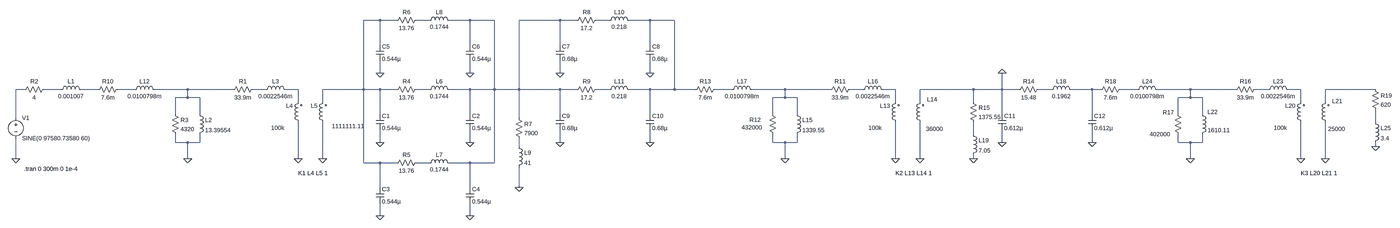
[diagram p0: schematic minhalinha .asc, whole sheet]
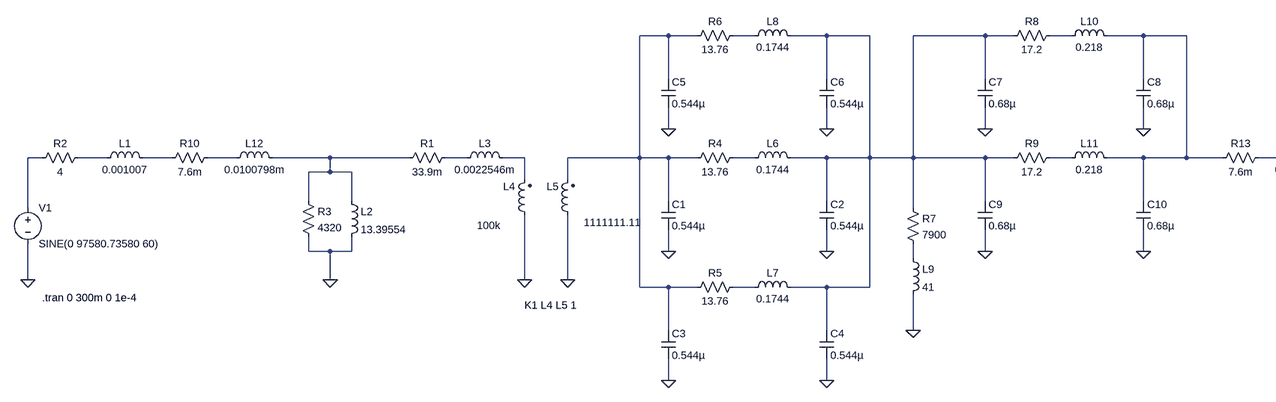
[diagram p1: schematic minhalinha .asc, part, row 1 of 1, column 1 of 2]
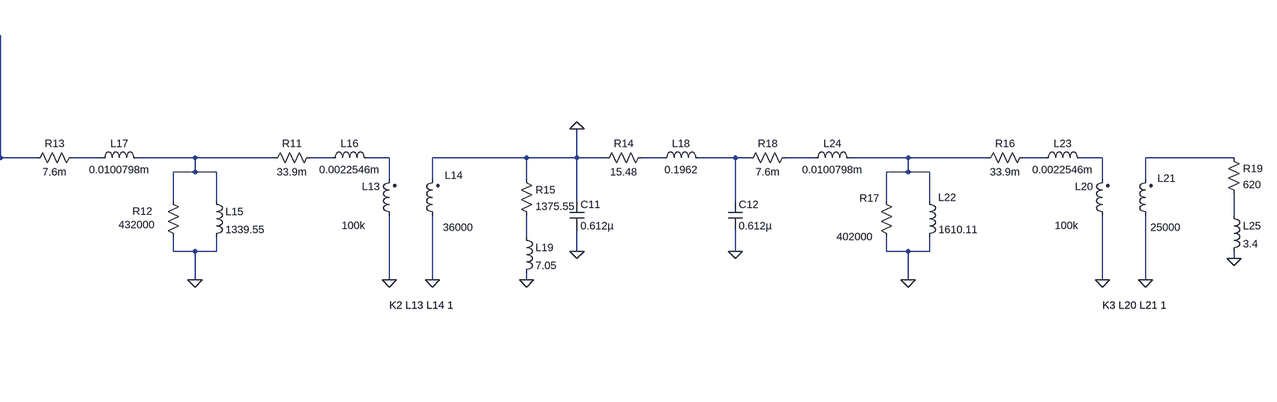
[diagram p2: schematic minhalinha .asc, part, row 1 of 1, column 2 of 2]
minhalinha .asc, the LTspice schematic file:
Version 4
SHEET 1 5188 680
WIRE 1200 -272 1136 -272
WIRE 1264 -272 1200 -272
WIRE 1392 -272 1344 -272
WIRE 1552 -272 1472 -272
WIRE 1648 -272 1552 -272
WIRE 1904 -272 1744 -272
WIRE 1968 -272 1904 -272
WIRE 2096 -272 2048 -272
WIRE 2256 -272 2176 -272
WIRE 2352 -272 2256 -272
WIRE 1200 -176 1200 -272
WIRE 1552 -176 1552 -272
WIRE 1904 -176 1904 -272
WIRE 2256 -176 2256 -272
WIRE 1200 -64 1200 -112
WIRE 1552 -64 1552 -112
WIRE 1904 -64 1904 -112
WIRE 2256 -64 2256 -112
WIRE -192 0 -224 0
WIRE -48 0 -112 0
WIRE 96 0 32 0
WIRE 240 0 176 0
WIRE 448 0 320 0
WIRE 624 0 448 0
WIRE 752 0 704 0
WIRE 880 0 832 0
WIRE 1136 0 1136 -272
WIRE 1136 0 976 0
WIRE 1200 0 1136 0
WIRE 1264 0 1200 0
WIRE 1392 0 1344 0
WIRE 1552 0 1472 0
WIRE 1648 0 1648 -272
WIRE 1648 0 1552 0
WIRE 1744 0 1744 -272
WIRE 1744 0 1648 0
WIRE 1904 0 1744 0
WIRE 1968 0 1904 0
WIRE 2096 0 2048 0
WIRE 2256 0 2176 0
WIRE 2352 0 2352 -272
WIRE 2352 0 2256 0
WIRE 2432 0 2352 0
WIRE 2576 0 2512 0
WIRE 2784 0 2656 0
WIRE 2960 0 2784 0
WIRE 3088 0 3040 0
WIRE 3216 0 3168 0
WIRE 3536 0 3312 0
WIRE 3648 0 3648 -64
WIRE 3648 0 3536 0
WIRE 3712 0 3648 0
WIRE 3840 0 3792 0
WIRE 4000 0 3920 0
WIRE 4032 0 4000 0
WIRE 4176 0 4112 0
WIRE 4384 0 4256 0
WIRE 4560 0 4384 0
WIRE 4688 0 4640 0
WIRE 4816 0 4768 0
WIRE 5120 0 4912 0
WIRE 448 32 448 0
WIRE 448 32 400 32
WIRE 496 32 448 32
WIRE 2784 32 2784 0
WIRE 2784 32 2736 32
WIRE 2832 32 2784 32
WIRE 4384 32 4384 0
WIRE 4384 32 4336 32
WIRE 4432 32 4384 32
WIRE 880 48 880 0
WIRE 976 48 976 0
WIRE 3216 48 3216 0
WIRE 3312 48 3312 0
WIRE 3536 48 3536 0
WIRE 4816 48 4816 0
WIRE 4912 48 4912 0
WIRE 400 96 400 32
WIRE 496 96 496 32
WIRE 1200 96 1200 0
WIRE 1552 96 1552 0
WIRE 1904 96 1904 0
WIRE 2256 96 2256 0
WIRE 2736 96 2736 32
WIRE 2832 96 2832 32
WIRE 3648 96 3648 0
WIRE 4000 96 4000 0
WIRE 4336 96 4336 32
WIRE 4432 96 4432 32
WIRE -224 112 -224 0
WIRE 1744 112 1744 0
WIRE 5120 128 5120 80
WIRE 3536 176 3536 128
WIRE 400 208 400 176
WIRE 448 208 400 208
WIRE 496 208 496 176
WIRE 496 208 448 208
WIRE 1200 208 1200 160
WIRE 1552 208 1552 160
WIRE 1904 208 1904 160
WIRE 2256 208 2256 160
WIRE 2736 208 2736 176
WIRE 2784 208 2736 208
WIRE 2832 208 2832 176
WIRE 2832 208 2784 208
WIRE 3648 208 3648 160
WIRE 4000 208 4000 160
WIRE 4336 208 4336 176
WIRE 4384 208 4336 208
WIRE 4432 208 4432 176
WIRE 4432 208 4384 208
WIRE 1744 224 1744 192
WIRE 5120 224 5120 208
WIRE -224 272 -224 192
WIRE 448 272 448 208
WIRE 880 272 880 128
WIRE 976 272 976 128
WIRE 2784 272 2784 208
WIRE 3216 272 3216 128
WIRE 3312 272 3312 128
WIRE 3536 272 3536 256
WIRE 4384 272 4384 208
WIRE 4816 272 4816 128
WIRE 4912 272 4912 128
WIRE 1136 288 1136 0
WIRE 1200 288 1136 288
WIRE 1264 288 1200 288
WIRE 1392 288 1344 288
WIRE 1552 288 1472 288
WIRE 1648 288 1648 0
WIRE 1648 288 1552 288
WIRE 1200 384 1200 288
WIRE 1552 384 1552 288
WIRE 1744 384 1744 304
WIRE 1200 496 1200 448
WIRE 1552 496 1552 448
FLAG -224 272 0
FLAG 448 272 0
FLAG 880 272 0
FLAG 976 272 0
FLAG 1200 208 0
FLAG 1552 208 0
FLAG 1200 496 0
FLAG 1552 496 0
FLAG 1200 -64 0
FLAG 1552 -64 0
FLAG 1744 384 0
FLAG 1904 -64 0
FLAG 2256 -64 0
FLAG 1904 208 0
FLAG 2256 208 0
FLAG 2784 272 0
FLAG 3216 272 0
FLAG 3312 272 0
FLAG 3648 208 0
FLAG 4000 208 0
FLAG 3536 272 0
FLAG 4384 272 0
FLAG 4816 272 0
FLAG 4912 272 0
FLAG 5120 224 0
FLAG 3648 -64 0
SYMBOL voltage -224 96 R0
WINDOW 123 0 0 Left 0
WINDOW 39 0 0 Left 0
SYMATTR InstName V1
SYMATTR Value SINE(0 97580.73580 60)
SYMBOL res -96 -16 R90
WINDOW 0 0 56 VBottom 2
WINDOW 3 32 56 VTop 2
SYMATTR InstName R2
SYMATTR Value 4
SYMBOL ind2 896 144 R180
WINDOW 0 36 80 Left 2
WINDOW 3 69 -7 Left 2
SYMATTR InstName L4
SYMATTR Value 100k
SYMATTR Type ind
SYMBOL ind2 992 144 R180
WINDOW 0 36 80 Left 2
WINDOW 3 -148 0 Left 2
SYMATTR InstName L5
SYMATTR Value 1111111.11
SYMATTR Type ind
SYMBOL res 720 -16 R90
WINDOW 0 0 56 VBottom 2
WINDOW 3 32 56 VTop 2
SYMATTR InstName R1
SYMATTR Value 33.9m
SYMBOL res 384 80 R0
SYMATTR InstName R3
SYMATTR Value 4320
SYMBOL ind -64 16 R270
WINDOW 0 32 56 VTop 2
WINDOW 3 5 56 VBottom 2
SYMATTR InstName L1
SYMATTR Value 0.001007
SYMBOL ind 480 80 R0
SYMATTR InstName L2
SYMATTR Value 13.39554
SYMBOL ind 736 16 R270
WINDOW 0 32 56 VTop 2
WINDOW 3 5 56 VBottom 2
SYMATTR InstName L3
SYMATTR Value 0.0022546m
SYMBOL res 1360 -16 R90
WINDOW 0 0 56 VBottom 2
WINDOW 3 32 56 VTop 2
SYMATTR InstName R4
SYMATTR Value 13.76
SYMBOL ind 1376 16 R270
WINDOW 0 32 56 VTop 2
WINDOW 3 5 56 VBottom 2
SYMATTR InstName L6
SYMATTR Value 0.1744
SYMBOL cap 1184 96 R0
SYMATTR InstName C1
SYMATTR Value 0.544µ
SYMBOL cap 1536 96 R0
SYMATTR InstName C2
SYMATTR Value 0.544µ
SYMBOL res 1360 272 R90
WINDOW 0 0 56 VBottom 2
WINDOW 3 32 56 VTop 2
SYMATTR InstName R5
SYMATTR Value 13.76
SYMBOL ind 1376 304 R270
WINDOW 0 32 56 VTop 2
WINDOW 3 5 56 VBottom 2
SYMATTR InstName L7
SYMATTR Value 0.1744
SYMBOL cap 1184 384 R0
SYMATTR InstName C3
SYMATTR Value 0.544µ
SYMBOL cap 1536 384 R0
SYMATTR InstName C4
SYMATTR Value 0.544µ
SYMBOL res 1360 -288 R90
WINDOW 0 0 56 VBottom 2
WINDOW 3 32 56 VTop 2
SYMATTR InstName R6
SYMATTR Value 13.76
SYMBOL ind 1376 -256 R270
WINDOW 0 32 56 VTop 2
WINDOW 3 5 56 VBottom 2
SYMATTR InstName L8
SYMATTR Value 0.1744
SYMBOL cap 1184 -176 R0
SYMATTR InstName C5
SYMATTR Value 0.544µ
SYMBOL cap 1536 -176 R0
SYMATTR InstName C6
SYMATTR Value 0.544µ
SYMBOL res 1728 96 R0
SYMATTR InstName R7
SYMATTR Value 7900
SYMBOL ind 1728 208 R0
SYMATTR InstName L9
SYMATTR Value 41
SYMBOL res 2064 -288 R90
WINDOW 0 0 56 VBottom 2
WINDOW 3 32 56 VTop 2
SYMATTR InstName R8
SYMATTR Value 17.2
SYMBOL ind 2080 -256 R270
WINDOW 0 32 56 VTop 2
WINDOW 3 5 56 VBottom 2
SYMATTR InstName L10
SYMATTR Value 0.218
SYMBOL cap 1888 -176 R0
SYMATTR InstName C7
SYMATTR Value 0.68µ
SYMBOL cap 2240 -176 R0
SYMATTR InstName C8
SYMATTR Value 0.68µ
SYMBOL res 2064 -16 R90
WINDOW 0 0 56 VBottom 2
WINDOW 3 32 56 VTop 2
SYMATTR InstName R9
SYMATTR Value 17.2
SYMBOL ind 2080 16 R270
WINDOW 0 32 56 VTop 2
WINDOW 3 5 56 VBottom 2
SYMATTR InstName L11
SYMATTR Value 0.218
SYMBOL cap 1888 96 R0
SYMATTR InstName C9
SYMATTR Value 0.68µ
SYMBOL cap 2240 96 R0
SYMATTR InstName C10
SYMATTR Value 0.68µ
SYMBOL ind 224 16 R270
WINDOW 0 32 56 VTop 2
WINDOW 3 5 56 VBottom 2
SYMATTR InstName L12
SYMATTR Value 0.0100798m
SYMBOL res 192 -16 R90
WINDOW 0 0 56 VBottom 2
WINDOW 3 32 56 VTop 2
SYMATTR InstName R10
SYMATTR Value 7.6m
SYMBOL ind2 3232 144 R180
WINDOW 0 36 80 Left 2
WINDOW 3 69 -7 Left 2
SYMATTR InstName L13
SYMATTR Value 100k
SYMATTR Type ind
SYMBOL ind2 3328 144 R180
WINDOW 0 -52 105 Left 2
WINDOW 3 -75 -11 Left 2
SYMATTR InstName L14
SYMATTR Value 36000
SYMATTR Type ind
SYMBOL res 3056 -16 R90
WINDOW 0 0 56 VBottom 2
WINDOW 3 32 56 VTop 2
SYMATTR InstName R11
SYMATTR Value 33.9m
SYMBOL res 2720 80 R0
WINDOW 0 -75 39 Left 2
WINDOW 3 -106 69 Left 2
SYMATTR InstName R12
SYMATTR Value 432000
SYMBOL ind 2816 80 R0
SYMATTR InstName L15
SYMATTR Value 1339.55
SYMBOL ind 3072 16 R270
WINDOW 0 32 56 VTop 2
WINDOW 3 5 56 VBottom 2
SYMATTR InstName L16
SYMATTR Value 0.0022546m
SYMBOL ind 2560 16 R270
WINDOW 0 32 56 VTop 2
WINDOW 3 5 56 VBottom 2
SYMATTR InstName L17
SYMATTR Value 0.0100798m
SYMBOL res 2528 -16 R90
WINDOW 0 0 56 VBottom 2
WINDOW 3 32 56 VTop 2
SYMATTR InstName R13
SYMATTR Value 7.6m
SYMBOL res 3808 -16 R90
WINDOW 0 0 56 VBottom 2
WINDOW 3 32 56 VTop 2
SYMATTR InstName R14
SYMATTR Value 15.48
SYMBOL ind 3824 16 R270
WINDOW 0 32 56 VTop 2
WINDOW 3 5 56 VBottom 2
SYMATTR InstName L18
SYMATTR Value 0.1962
SYMBOL cap 3632 96 R0
SYMATTR InstName C11
SYMATTR Value 0.612µ
SYMBOL cap 3984 96 R0
SYMATTR InstName C12
SYMATTR Value 0.612µ
SYMBOL res 3520 32 R0
SYMATTR InstName R15
SYMATTR Value 1375.55
SYMBOL ind 3520 160 R0
SYMATTR InstName L19
SYMATTR Value 7.05
SYMBOL ind2 4832 144 R180
WINDOW 0 36 80 Left 2
WINDOW 3 69 -7 Left 2
SYMATTR InstName L20
SYMATTR Value 100k
SYMATTR Type ind
SYMBOL ind2 4928 144 R180
WINDOW 0 -51 98 Left 2
WINDOW 3 -62 -11 Left 2
SYMATTR InstName L21
SYMATTR Value 25000
SYMATTR Type ind
SYMBOL res 4656 -16 R90
WINDOW 0 0 56 VBottom 2
WINDOW 3 32 56 VTop 2
SYMATTR InstName R16
SYMATTR Value 33.9m
SYMBOL res 4320 80 R0
WINDOW 0 -44 10 Left 2
WINDOW 3 -95 96 Left 2
SYMATTR InstName R17
SYMATTR Value 402000
SYMBOL ind 4416 80 R0
WINDOW 0 35 8 Left 2
SYMATTR InstName L22
SYMATTR Value 1610.11
SYMBOL ind 4672 16 R270
WINDOW 0 32 56 VTop 2
WINDOW 3 5 56 VBottom 2
SYMATTR InstName L23
SYMATTR Value 0.0022546m
SYMBOL ind 4160 16 R270
WINDOW 0 32 56 VTop 2
WINDOW 3 5 56 VBottom 2
SYMATTR InstName L24
SYMATTR Value 0.0100798m
SYMBOL res 4128 -16 R90
WINDOW 0 0 56 VBottom 2
WINDOW 3 32 56 VTop 2
SYMATTR InstName R18
SYMATTR Value 7.6m
SYMBOL res 5104 -16 R0
SYMATTR InstName R19
SYMATTR Value 620
SYMBOL ind 5104 112 R0
SYMATTR InstName L25
SYMATTR Value 3.4
TEXT -192 312 Left 2 !.tran 0 300m 0 1e-4
TEXT 880 328 Left 2 !K1 L4 L5 1
TEXT 3216 328 Left 2 !K2 L13 L14 1
TEXT 4816 328 Left 2 !K3 L20 L21 1

The netlist it stands for:
* minhalinha .asc
V1 N006 0 SINE(0 97580.73580 60)
R2 N007 N006 4
L4 0 N012 100k
L5 0 N001 1111111.11
R1 N011 N010 33.9m
R3 N010 0 4320
L1 N007 N008 0.001007
L2 N010 0 13.39554
L3 N011 N012 0.0022546m
R4 N013 N001 13.76
L6 N013 N003 0.1744
C1 N001 0 0.544µ
C2 N003 0 0.544µ
R5 N029 N001 13.76
L7 N029 N003 0.1744
C3 N001 0 0.544µ
C4 N003 0 0.544µ
R6 N002 N001 13.76
L8 N002 N003 0.1744
C5 N001 0 0.544µ
C6 N003 0 0.544µ
R7 N003 N028 7900
L9 N028 0 41
R8 N004 N003 17.2
L10 N004 N005 0.218
C7 N003 0 0.68µ
C8 N005 0 0.68µ
R9 N014 N003 17.2
L11 N014 N005 0.218
C9 N003 0 0.68µ
C10 N005 0 0.68µ
L12 N009 N010 0.0100798m
R10 N009 N008 7.6m
L13 0 N018 100k
L14 0 0 36000
R11 N017 N016 33.9m
R12 N016 0 432000
L15 N016 0 1339.55
L16 N017 N018 0.0022546m
L17 N015 N016 0.0100798m
R13 N015 N005 7.6m
R14 N019 0 15.48
L18 N019 N020 0.1962
C11 0 0 0.612µ
C12 N020 0 0.612µ
R15 0 N027 1375.55
L19 N027 0 7.05
L20 0 N024 100k
L21 0 N025 25000
R16 N023 N022 33.9m
R17 N022 0 402000
L22 N022 0 1610.11
L23 N023 N024 0.0022546m
L24 N021 N022 0.0100798m
R18 N021 N020 7.6m
R19 N025 N026 620
L25 N026 0 3.4
.tran 0 300m 0 1e-4
K1 L4 L5 1
K2 L13 L14 1
K3 L20 L21 1
.backanno
.end